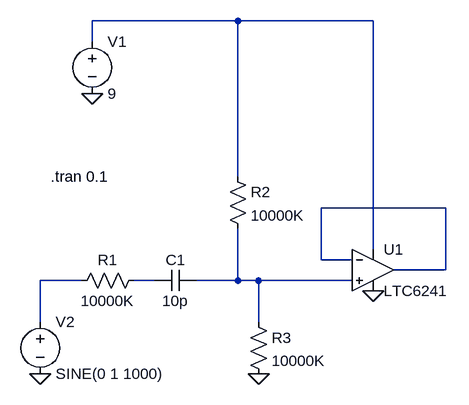
[diagram p0: schematic pz_pre_ip_stage.asc]
pz_pre_ip_stage.asc, the LTspice schematic file:
Version 4
SHEET 1 880 680
WIRE 16 -224 -208 -224
WIRE 224 -224 16 -224
WIRE -208 -192 -208 -224
WIRE 16 16 16 -224
WIRE 336 64 144 64
WIRE 224 128 224 -224
WIRE 144 144 144 64
WIRE 192 144 144 144
WIRE 336 160 336 64
WIRE 336 160 256 160
WIRE -224 176 -288 176
WIRE -112 176 -144 176
WIRE 16 176 16 96
WIRE 16 176 -48 176
WIRE 48 176 16 176
WIRE 192 176 48 176
WIRE -288 240 -288 176
WIRE 48 240 48 176
FLAG 224 192 0
FLAG -208 -112 0
FLAG -288 320 0
FLAG 48 320 0
SYMBOL Opamps\\LTC6241 224 160 R0
SYMATTR InstName U1
SYMBOL voltage -208 -208 R0
WINDOW 123 0 0 Left 2
WINDOW 39 0 0 Left 2
SYMATTR InstName V1
SYMATTR Value 9
SYMBOL voltage -288 224 R0
WINDOW 123 0 0 Left 2
WINDOW 39 0 0 Left 2
SYMATTR InstName V2
SYMATTR Value SINE(0 1 1000)
SYMBOL res -128 160 R90
WINDOW 0 0 56 VBottom 2
WINDOW 3 32 56 VTop 2
SYMATTR InstName R1
SYMATTR Value 10000K
SYMBOL cap -48 160 R90
WINDOW 0 0 32 VBottom 2
WINDOW 3 32 32 VTop 2
SYMATTR InstName C1
SYMATTR Value 10p
SYMBOL res 0 0 R0
SYMATTR InstName R2
SYMATTR Value 10000K
SYMBOL res 32 224 R0
SYMATTR InstName R3
SYMATTR Value 10000K
TEXT -272 16 Left 2 !.tran 0.1

The netlist it stands for:
* pz_pre_ip_stage.asc
XU1 N005 N002 N001 0 N002 LTC6241  ; pins In+ In- V+ V- OUT
V1 N001 0 9
V2 N003 0 SINE(0 1 1000)
R1 N004 N003 10000K
C1 N005 N004 10p
R2 N001 N005 10000K
R3 N005 0 10000K
.tran 0.1
.lib LTC4.lib
.backanno
.end